# Altium schematic sheet 13 USB.SchDoc
size A2; ApprovedBy: DNP; CheckedBy: DNP; Author: DNP; CompanyName: Google LLC; DrawnBy: DNP; Organization: Google LLC; Address1: 1600 Amphitheatre Parkway; Address2: Mountain View, CA 94043; Address3: DNP; Address4: DNP; DocumentNumber: 13; SheetNumber: 13; SheetTotal: 17; VersionControl_RevNumber: DNP; IsUserConfigurable: DNP; Time: DNP; ImagePath: DNP; Rule: DNP; ProjectName: Enterprise; Application_BuildNumber: DNP
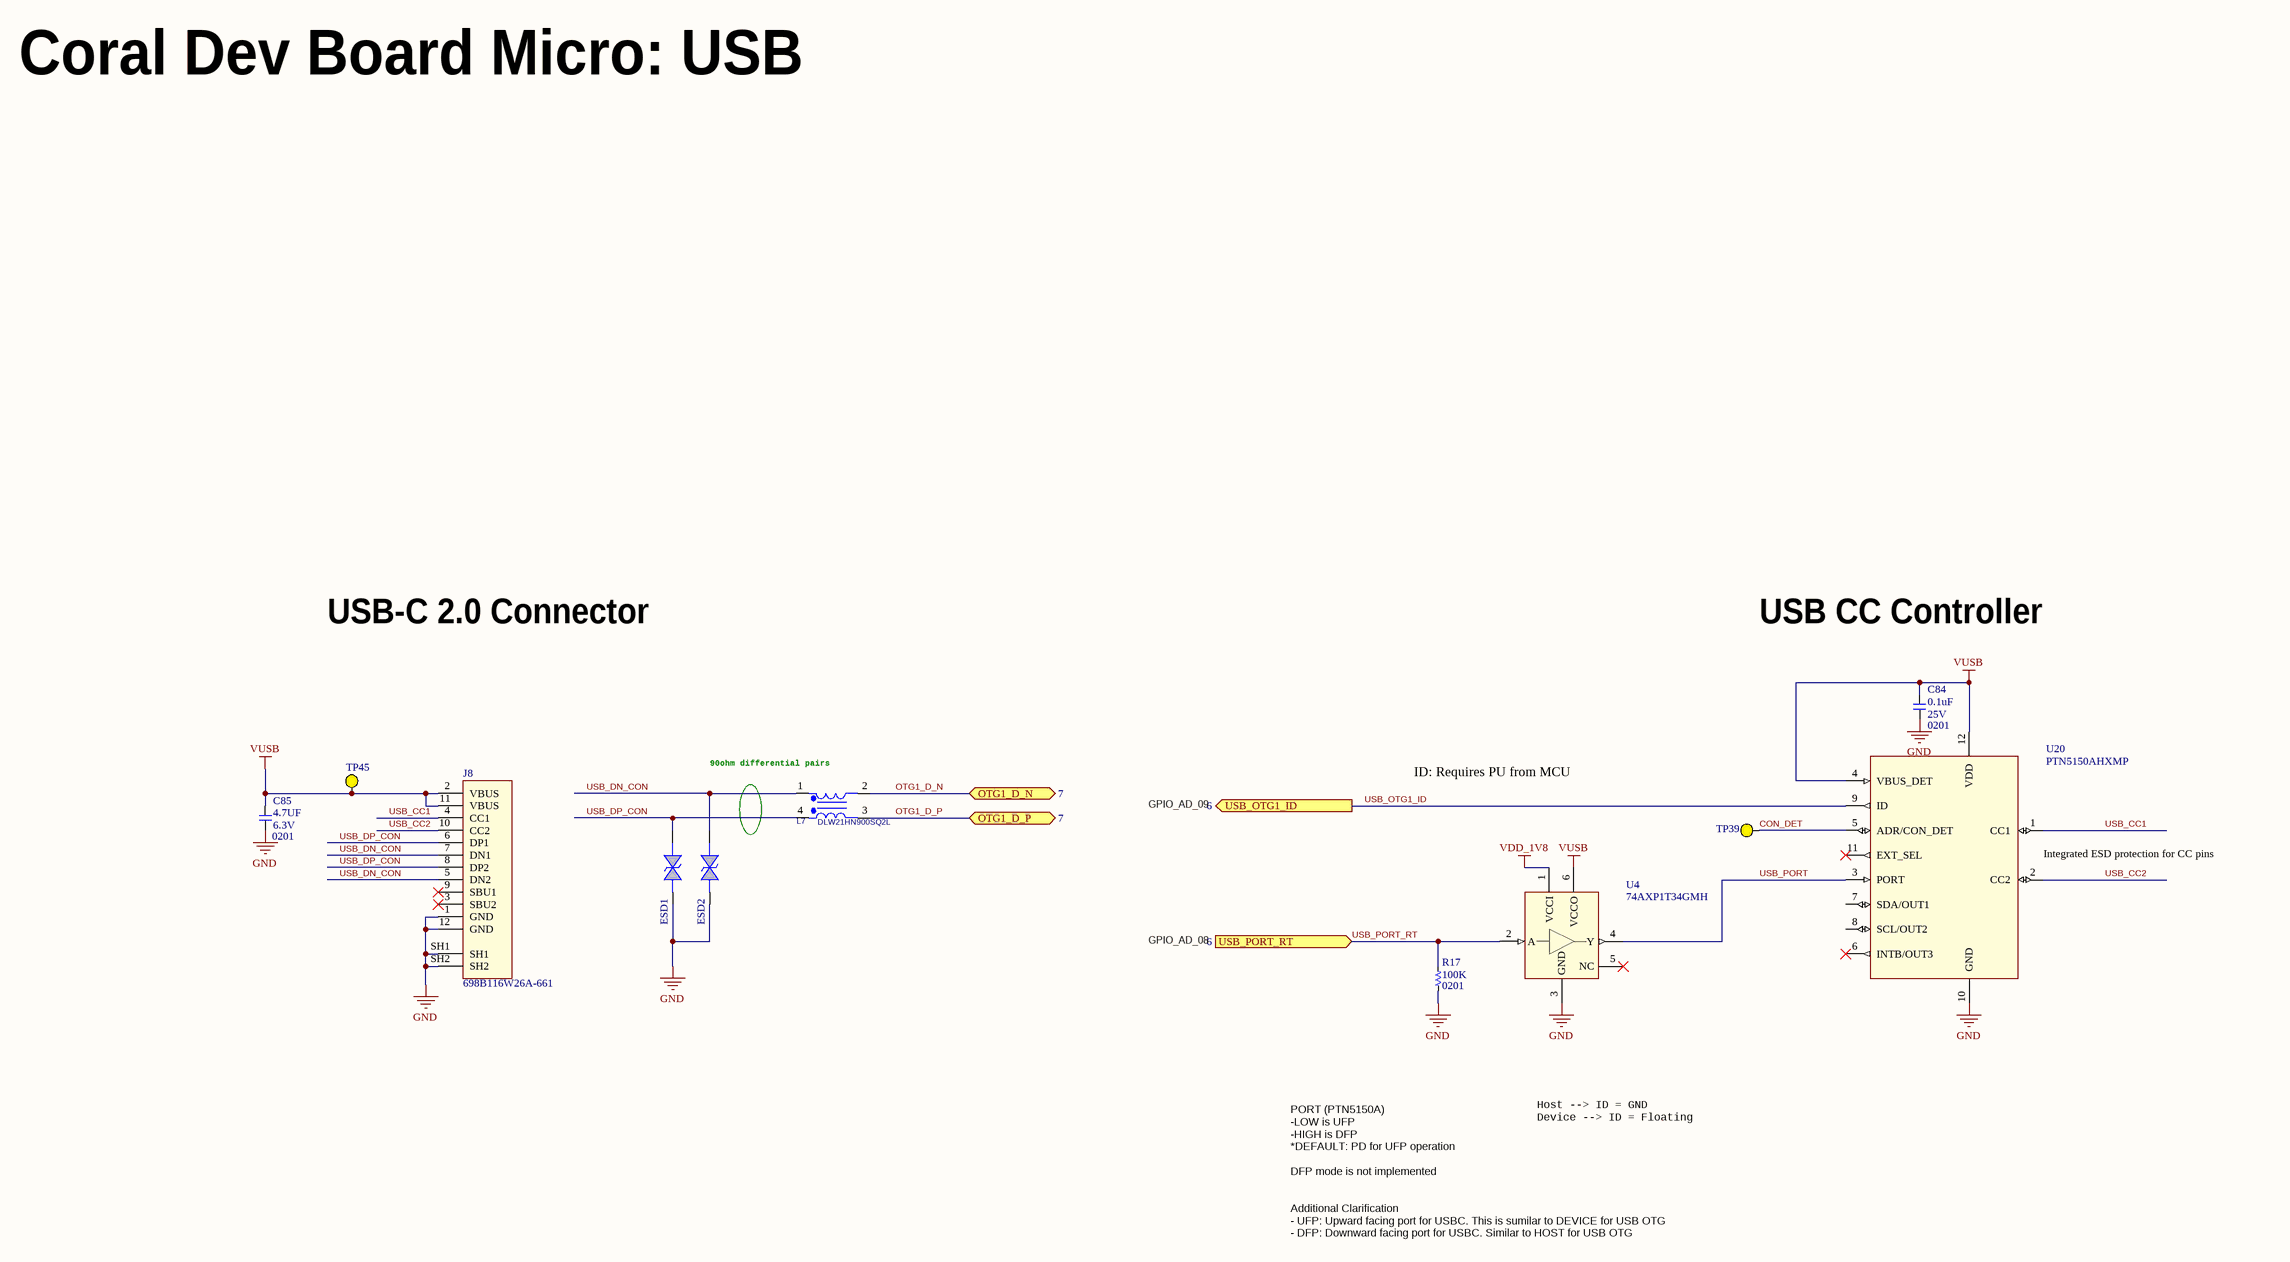
[diagram p0: 13 USB.SchDoc]

## Parts
C84  value 0.1uF  Package: 0201  Voltage: 25V  [C0201Y]  (hidden comment: __Template_Cap)
C85  value 4.7UF  Package: 0201  Voltage: 6.3V  [C0201Y]  (hidden comment: __Template_Cap)
ESD1  3.5pF/5V  [0201]  (value not drawn)
ESD2  3.5pF/5V  [0201]  (value not drawn)
J8  MFG P/N: 698B116W26A-661  [EDAC_698B116W26A-661]
L7  DLW21HN900SQ2L  [IND4_CHOKE_0805]
R17  value 100K  Package: 0201  [R0201]
TP39  TESTPAD_30MIL  [TESTPAD_SMT_30MIL]  (value not drawn)  (no BOM)
TP45  TESTPAD_30MIL  [TESTPAD_SMT_30MIL]  (value not drawn)  (no BOM)
U4  MFG P/N: 74AXP1T34GMH  [SON50P145X100X50-6]  (hidden comment: TRANSLATOR_74AXP1T34GMH)
U20  MFG P/N: PTN5150AHXMP  [X2QFN12_1.6X1.6MMM]  (hidden comment: CONTROLLER_PTN5150AHXMP)

## Ports
OTG1_D_N (bidir, see 7), OTG1_D_P (bidir, see 7), USB_OTG1_ID (out, see 6), USB_PORT_RT (in, see 6)

## Nets
GND: C84.2 C85.2 ESD1.1 ESD2.1 J8.1(GND) J8.12(GND) J8.SH1 J8.SH2 R17.1 U4.3(GND) U20.10(GND)
VDD_1V8: U4.1(VCCI)
VUSB: C84.1 C85.1 J8.2(VBUS) J8.11(VBUS) TP45.1 U4.6(VCCO) U20.4(VBUS_DET) U20.12(VDD)
CON_DET: TP39.1 U20.5(ADR/CON_DET)
OTG1_D_N: L7.2 ; port OTG1_D_N
OTG1_D_P: L7.3 ; port OTG1_D_P
USB_CC1: J8.4(CC1) U20.1(CC1)
USB_CC2: J8.10(CC2) U20.2(CC2)
USB_DN_CON: ESD2.2 J8.5(DN2) J8.7(DN1) L7.1
USB_DP_CON: ESD1.2 J8.6(DP1) J8.8(DP2) L7.4
USB_OTG1_ID: U20.9(ID) ; port USB_OTG1_ID
USB_PORT: U4.4(Y) U20.3(PORT)
USB_PORT_RT: R17.2 U4.2(A) ; port USB_PORT_RT

Not connected (* = marked no-connect by the designer): J8 3(SBU2)* 9(SBU1)*; U4 5(NC)*; U20 6(INTB/OUT3)* 7(SDA/OUT1) 8(SCL/OUT2) 11(EXT_SEL)*

## Notes on the sheet
- Coral Dev Board Micro: USB
- USB-C 2.0 Connector
- USB CC Controller
- (near L7) 90ohm differential pairs
- ID: Requires PU from MCU
- GPIO_AD_09
- (near U20) Integrated ESD protection for CC pins
- GPIO_AD_08
- Host --> ID = GND
  Device --> ID = Floating
- PORT (PTN5150A)
  -LOW is UFP
  -HIGH is DFP
  *DEFAULT: PD for UFP operation
  DFP mode is not implemented
- Additional Clarification
  - UFP: Upward facing port for USBC. This is sumilar to DEVICE for USB OTG
  - DFP: Downward facing port for USBC. Similar to HOST for USB OTG
- Project:
- Engineer:
- Date:
- File:
- Revision:
- Sheet
- of

## Library data of the parts
C84 = 386: CAP, CER, X5R, 0.1uF, 25V, 20%, 0201, 0.33mm T; ID: 386; MFG: MURATA; MFG P/N: GRM033R61E104ME14D; XPN: 150-01204-00; Status: Released; Dielectric: X5R; Tolerance: 20%; Height: 0.33mm T; ComponentLink1Description: Datasheet; COMMON: 150-01204-00; LOON: 150-01204-00; Gecko: 150-01204-00
C85 = 1199: CAP, CER, X5R, 4.7uF, 20%, 6.3V, 0201; ID: 1199; MFG: MURATA; MFG P/N: GRM035R60J475ME15D; XPN: 150-01224-00; PROXY: 150-03477-00; Status: Released; Dielectric: X5R; Tolerance: 20%; Height: 0.33mm T; ComponentLink1Description: Datasheet; COMMON: 150-01224-00; LOON: 150-01224-00; Gecko: 150-01224-00
ESD1 ESD2 = DIODE BI-DIR TRIG: DIODE TVS 15kV 10V 50A 8pF SMT RoHS; MPN: DESD5V0V1BCSP-7; QPN: BC5V0V1BZ02; QPN Description: DIODE ESD SMD DESD5V0V1BCSP-7 6V,DSN0603; Function Code: USB; QCI MPN: DESD5V0V1BCSP-7; QCI Supplier: DDS
J8 = 1283: CONN, USB-C, RCPT, RA, USB 2.0, 16 P, 0.5MM PITCH, GOLD, SMT; ID: 1283; MFG: EDAC Inc; Number of Positions: 12; Current Rating: 3A; Voltage, Rated: 100VAC; Sub Assy Qty 2: 0; Status: Released; RoHS Compliant: Yes; Mounting Type: Surface Mount; Orientation: Right Angle; Number of Rows: 1; Operating Temperature: -30°C ~ 85°C; ComponentLink1Description: Datasheet; ComponentLink1URL: https://drive.google.com/corp/drive/folders/1cT-VNuTRhR0OJylJtjEkdbP9sP_ssI5q; Height: 2.71mm; Sub Assy Qty 3: 0; Sub Assy Qty 4: 0
L7 = IND_CMC_DLW21: IND CHK 90 OHM@100MHZ 330MA 25% 0805; QPN: CX1HN900000; QPN Description: EMI FILTER DLW21HN900SQ2L(90,330MA); Function Code: DBG; Supplier 1: Digi-Key; Supplier Part Number 1: 490-1064-1-ND; MPN: DLW21HN900SQ2L; QCI MPN: DLW21HN900SQ2L; QCI Supplier: MUR
R17 = 7818: RES, 100K, 1%, 1/20W, 0201; ID: 7818; MFG: PANASONIC; MFG P/N: ERJ1GEF1003C; COMMON: 470-00506-00; Status: NRND; Power: 1/20W; Tolerance: 1%; LOON: 470-00506-00; Gecko: 470-00506-00; XPN: 470-00506-00
TP39 TP45 = 178: TESTPAD_SMT_30MIL; ID: 178; MFG: _PCB Feature; Status: Released; ComponentLink1URL: _PCB Feature
U4 = 441: IC, TRANSLATOR, 74AXP1, UNIDIR, 1-CH, NON-INVERTED O/P, LOW NOISE OVERSHOOT, XSON-6; ID: 441; MFG: Nexperia USA Inc.; Status: Released; Package: 6-XSON, SOT886 (1.45x1); Category: Integrated Circuits (ICs); RoHS Compliant: Yes; Supplier 1: Digi-Key; ComponentLink1Description: Datasheet; ComponentLink1URL: https://assets.nexperia.com/documents/data-sheet/74AXP1T34.pdf; Mounting Type: SMD; Height: 0.5mm; Supplier Part Number 1: 1727-2482-2-ND; HelpURL: https://www.digikey.com/en/products/detail/nexperia-usa-inc/74AXP1T34GMH/5971133?s=N4IgTCBcDaIOwBYCCANACgRgCoGYEHEBZACRAF0BfIA
U20 = 224: IC, HOST CTLR, PTN5150A, USB, 2.7 TO 5.5 VIN, X2QFN-12; ID: 224; MFG: NXP USA Inc.; Status: Released; Package: 12-X2QFN (1.6x1.6); RoHS Compliant: YES; Supplier 1: Digi-Key; HelpURL: https://www.digikey.in/product-detail/en/nxp-usa-inc/PTN5150AHXMP/568-13083-1-ND/6569882; ComponentLink1Description: Datasheet; ComponentLink1URL: https://www.nxp.com/docs/en/data-sheet/PTN5150A.pdf; Mounting Type: SMD; Supplier Part Number 1: 568-13083-1-ND